# EAGLE design scentclock_2 (EAGLE 5.07)
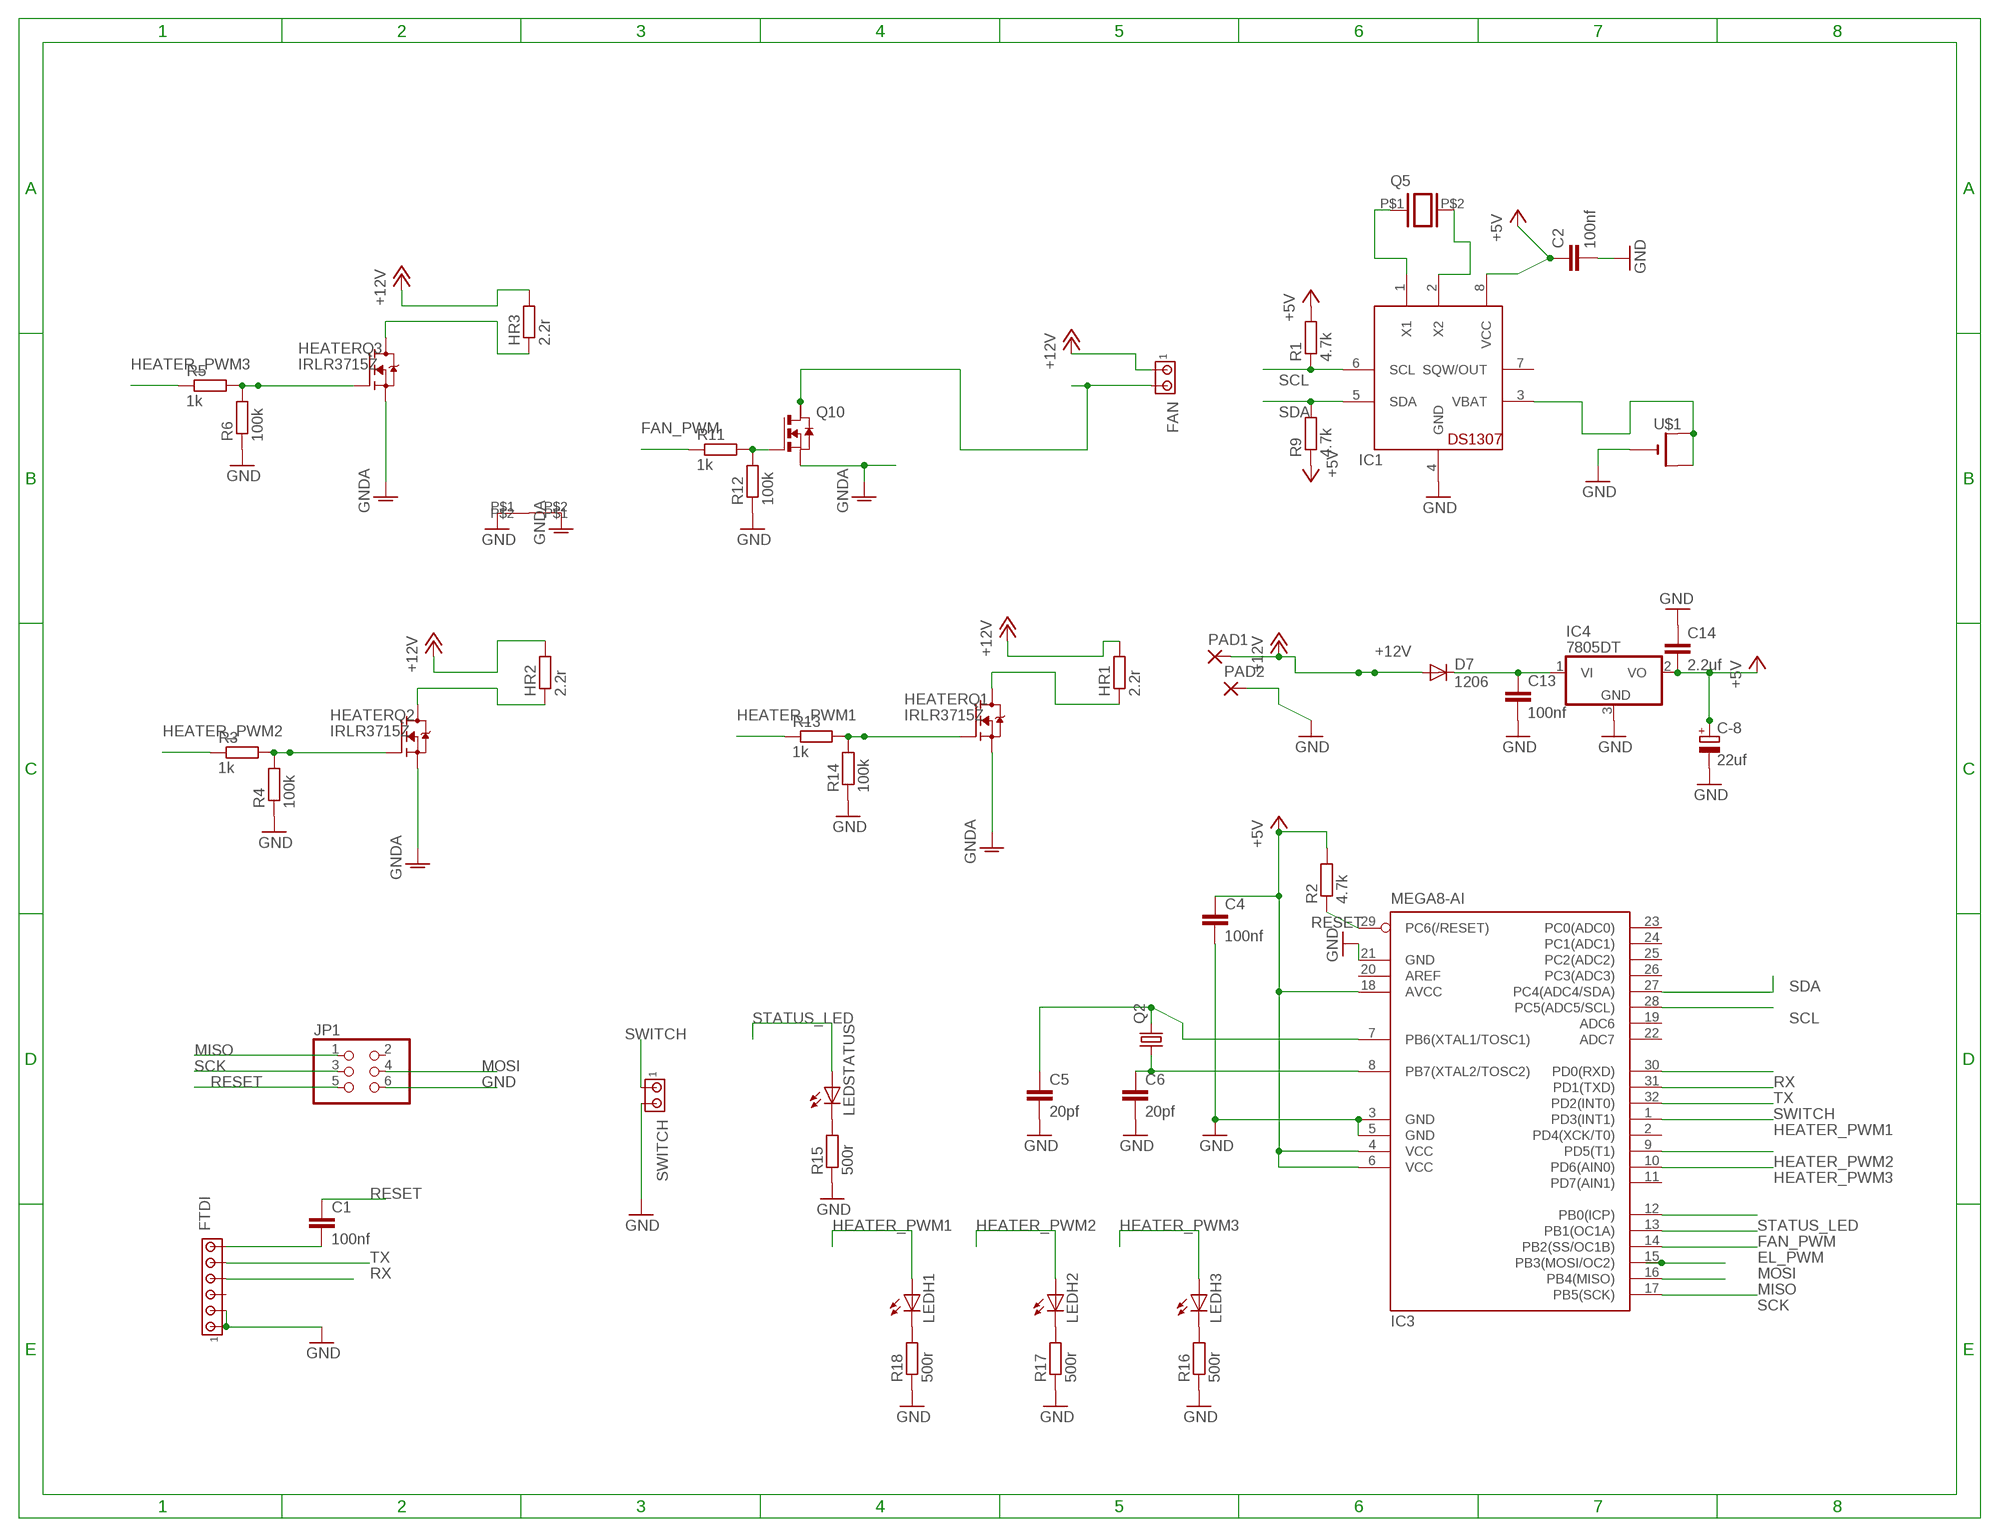
[diagram p0: schematic, sheet 1]

## Parts
C1  100nf  C-EUC1206  [C1206]
C2  100nf  C-EUC1206  [C1206]
C4  100nf  C-EUC1206  [C1206]
C5  20pf  C-EUC1206  [C1206]
C6  20pf  C-EUC1206  [C1206]
C13  100nf  C-EUC1206  [C1206]
C14  2.2uf  C-EUC1206  [C1206]
C-8  22uf  CPOL-EUSMCD  [SMC_D]
D7  1206  DIODE-GF1  [GF1]
FAN  MTA02-100  [10X02MTA]
FTDI  MTA06-100  [10X06MTA]
HEATERQ1  IRLR3715Z  [TO252]
HEATERQ2  IRLR3715Z  [TO252]
HEATERQ3  IRLR3715Z  [TO252]
HR1  2.2r  R-EU_0613/15  [P0613/15]
HR2  2.2r  R-EU_0613/15  [P0613/15]
HR3  2.2r  R-EU_0613/15  [P0613/15]
IC1  DS1307  DS1307SOO8  [SO08]
IC3  MEGA8-AI  [TQFP32-08]
IC4  7805DT  [TO252]
JP1  PINHD-2X3  [2X03]
LEDH1  LEDSMT1206  [1206]
LEDH2  LEDSMT1206  [1206]
LEDH3  LEDSMT1206  [1206]
LEDSTATUS  LEDSMT1206  [1206]
PAD1  2,15/1,0  [2,15/1,0]
PAD2  2,15/1,0  [2,15/1,0]
Q2  CRYSTALHC49UP  [HC49UP]
Q5  XTALSMT  [CC4VCRYSTAL]
Q10  NMOSSOT223  [SOT223]
R1  4.7k  R-EU_R1206  [R1206]
R2  4.7k  R-EU_R1206  [R1206]
R3  1k  R-EU_M1206  [M1206]
R4  100k  R-EU_M1206  [M1206]
R5  1k  R-EU_M1206  [M1206]
R6  100k  R-EU_M1206  [M1206]
R9  4.7k  R-EU_R1206  [R1206]
R11  1k  R-EU_M1206  [M1206]
R12  100k  R-EU_M1206  [M1206]
R13  1k  R-EU_M1206  [M1206]
R14  100k  R-EU_M1206  [M1206]
R15  500r  R-EU_R1206  [R1206]
R16  500r  R-EU_R1206  [R1206]
R17  500r  R-EU_R1206  [R1206]
R18  500r  R-EU_R1206  [R1206]
SWITCH  MTA02-100  [10X02MTA]
U$1  CR1220SMT  [CR1220-SMD]
U$4  SHORT  [SHORT]

## Nets
+5V: C2.1 C4.1 C14.2 C-8.+ IC1.8(VCC) IC3.4(VCC) IC3.6(VCC) IC3.18(AVCC) IC4.2(VO) R1.2 R2.2 R9.1
+12V [power]: D7.A FAN.1 HR1.2 HR2.2 HR3.2 PAD1.1(P)
EL_PWM: IC3.14(PB2(SS/OC1B))
FAN_PWM: IC3.13(PB1(OC1A)) R11.1
GND [power]: C2.2 C4.2 C5.2 C6.2 C13.2 C14.1 C-8.- FTDI.5 FTDI.6 IC1.4(GND) IC3.3(GND) IC3.5(GND) IC3.21(GND) IC4.3(GND) JP1.6 PAD2.1(P) R4.1 R6.1 R12.1 R14.1 R15.1 R16.1 R17.1 R18.1 SWITCH.2 U$1.- U$4.P$1
GNDA [power]: HEATERQ1.2(S) HEATERQ2.2(S) HEATERQ3.2(S) Q10.3(S) U$4.P$2
HEATER [medpower]: HEATERQ1.3(D) HR1.1
HEATER1 [medpower]: HEATERQ2.3(D) HR2.1
HEATER2 [medpower]: HEATERQ3.3(D) HR3.1
HEATER_PWM1: IC3.1(PD3(INT1)) LEDH1.A R13.1
HEATER_PWM2: IC3.9(PD5(T1)) LEDH2.A R3.1
HEATER_PWM3: IC3.10(PD6(AIN0)) LEDH3.A R5.1
MISO: IC3.16(PB4(MISO)) JP1.1
MOSI: IC3.15(PB3(MOSI/OC2)) JP1.4
N$1: HEATERQ2.1(G) R3.2 R4.2
N$2: HEATERQ3.1(G) R5.2 R6.2
N$3: IC1.1(X1) Q5.P$1
N$4 [medpower]: C13.1 D7.C IC4.1(VI)
N$5: C1.2 FTDI.1
N$6: IC1.3(VBAT) U$1.+$1(+) U$1.+$2(+1)
N$7: LEDSTATUS.C R15.2
N$8 [power]: FAN.2 Q10.2(D)
N$9: IC1.2(X2) Q5.P$2
N$10: C6.1 IC3.8(PB7(XTAL2/TOSC2)) Q2.1
N$11: C5.1 IC3.7(PB6(XTAL1/TOSC1)) Q2.2
N$12: LEDH3.C R16.2
N$13: Q10.1(G) R11.2 R12.2
N$14: HEATERQ1.1(G) R13.2 R14.2
N$15: LEDH2.C R17.2
N$16: LEDH1.C R18.2
RESET: C1.1 IC3.29(PC6(/RESET)) JP1.5 R2.1
RX: FTDI.3 IC3.30(PD0(RXD))
SCK: IC3.17(PB5(SCK)) JP1.3
SCL: IC1.6(SCL) IC3.28(PC5(ADC5/SCL)) R1.1
SDA: IC1.5(SDA) IC3.27(PC4(ADC4/SDA)) R9.2
STATUS_LED: IC3.12(PB0(ICP)) LEDSTATUS.A
SWITCH: IC3.32(PD2(INT0)) SWITCH.1
TX: FTDI.2 IC3.31(PD1(TXD))
Unconnected: FTDI.4 IC1.7(SQW/OUT) IC3.2(PD4(XCK/T0)) IC3.11(PD7(AIN1)) IC3.19(ADC6) IC3.20(AREF) IC3.22(ADC7) IC3.23(PC0(ADC0)) IC3.24(PC1(ADC1)) IC3.25(PC2(ADC2)) IC3.26(PC3(ADC3)) JP1.2 Q10.4(D2)

## Library data of the parts
C1 C2 C4-C6 = matt rcl:C-EU: CAPACITOR, European symbol
C13 C14 = resistor:C-EU: CAPACITOR, European symbol
C-8 = matt rcl:CPOL-EU: POLARIZED CAPACITOR, European symbol
D7 = matt diode:DIODE-: DIODE
FAN SWITCH = matt con-amp:MTA02-100: AMP connector
FTDI = matt con-amp:MTA06-100: AMP connector
HEATERQ1-HEATERQ3 = matt transistor-fet:IRLR3715Z
HR1-HR3 R1 R2 R9 R15-R18 = matt rcl:R-EU_: RESISTOR, European symbol
IC1 = adafruit:DS1307: DS1307 Real time clock (RTC) with battery backup ability. Talk to it via i2c
IC3 = matt atmel:MEGA8: MICROCONTROLLER 8 Kbytes FLASH, 1 kbytes SRAM, 512 bytes EEPROM, USART, 6-channel 10 bit ADC, 2-channel 8 bit ADC Pin compatible with Atmega48, ATMega88, ATMega168 Source: avr.lbr
IC4 = linear:78*: Positive VOLTAGE REGULATOR Source: http://cache.national.com/ds/LM/LM78L05.pdf http://www.fairchildsemi.com/ds/LM/LM7805.pdf
JP1 = pinhead:PINHD-2X3: PIN HEADER
LEDH1-LEDH3 LEDSTATUS = matt led:LED: LED OSRAM: - CHIPLED LG R971, LG N971, LY N971, LG Q971, LY Q971, LO R971, LY R971 LH N974, LH R974 LS Q976, LO Q976, LY Q976 LO Q996 - Hyper CHIPLED LW Q18S LB Q993, LB Q99A, LB R99A - SideLED LS A670, LO A670, LY A670, LG A670, LP A670 LB A673, LV A673, LT A673, LW A673 LH A674 LY A675 LS A676, LA A676, LO A676, LY A676, LW A676 LS A679, LY A679, LG A679 - Hyper Micro SIDELED® LS Y876, LA Y876, LO Y876, LY Y876 LT Y87S - SmartLED LW L88C, LW L88S LB L89C, LB L89S, LG L890 LS L89K, LO L89K, LY L89K LS L896, LA L896, LO L896, LY L896 - TOPLED LS T670, LO T670, LY T670, LG T670, LP T670 LSG T670, LSP T670, LSY T670, LOP T670, LYG T670 LG T671, LOG T671, LSG T671 LB T673, LV T673, LT T673, LW T673 LH T674 LS T676, LA T676, LO T676, LY T676, LB T676, LH T676, LSB T676, LW T676 LB T67C, LV T67C, LT T67C, LS T67K, LO T67K, LY T67K, LW E67C LS E67B, LA E67B, LO E67B, LY E67B, LB E67C, LV E67C, LT E67C LW T67C LS T679, LY T679, LG T679 LS T770, LO T770, LY T770, LG T770, LP T770 LB T773, LV T773, LT T773, LW T773 LH T774 LS E675, LA E675, LY E675, LS T675 LS T776, LA T776, LO T776, LY T776, LB T776 LHGB T686 LT T68C, LB T68C - Hyper Mini TOPLED® LB M676 - Mini TOPLED Santana® LG M470 LS M47K, LO M47K, LY M47K Source: http://www.osram.convergy.de LUXEON: - LUMILED® LXK2-PW12-R00, LXK2-PW12-S00, LXK2-PW14-U00, LXK2-PW14-V00 LXK2-PM12-R00, LXK2-PM12-S00, LXK2-PM14-U00 LXK2-PE12-Q00, LXK2-PE12-R00, LXK2-PE12-S00, LXK2-PE14-T00, LXK2-PE14-U00 LXK2-PB12-K00, LXK2-PB12-L00, LXK2-PB12-M00, LXK2-PB14-N00, LXK2-PB14-P00, LXK2-PB14-Q00 LXK2-PR12-L00, LXK2-PR12-M00, LXK2-PR14-Q00, LXK2-PR14-R00 LXK2-PD12-Q00, LXK2-PD12-R00, LXK2-PD12-S00 LXK2-PH12-R00, LXK2-PH12-S00 LXK2-PL12-P00, LXK2-PL12-Q00, LXK2-PL12-R00 Source: www.luxeon.com KINGBRIGHT: KA-3528ASYC Source: www.kingbright.com
PAD1 PAD2 = wirepad:2,15/1,0: THROUGH-HOLE PAD
Q2 = crystal:CRYSTAL: CRYSTAL
Q5 = matt special:XTAL: CRYSTAL
Q10 = zetex:NMOSSOT223: MOS FET
R3-R6 R11-R14 = resistor:R-EU_: RESISTOR, European symbol
U$1 = adafruit:CR1220: CR1216/CR1220/CR1225 12mm 3V lithium coin cell Great for battery packup. Both SMT and THM holders. Note the THM package has the ground pads on both sides of the PCB so that the masks are the same - this reduces the cost
U$4 = matt:SHORT

## Net classes
1 power: width 3 mm
2 medpower: width 1 mm

## Board
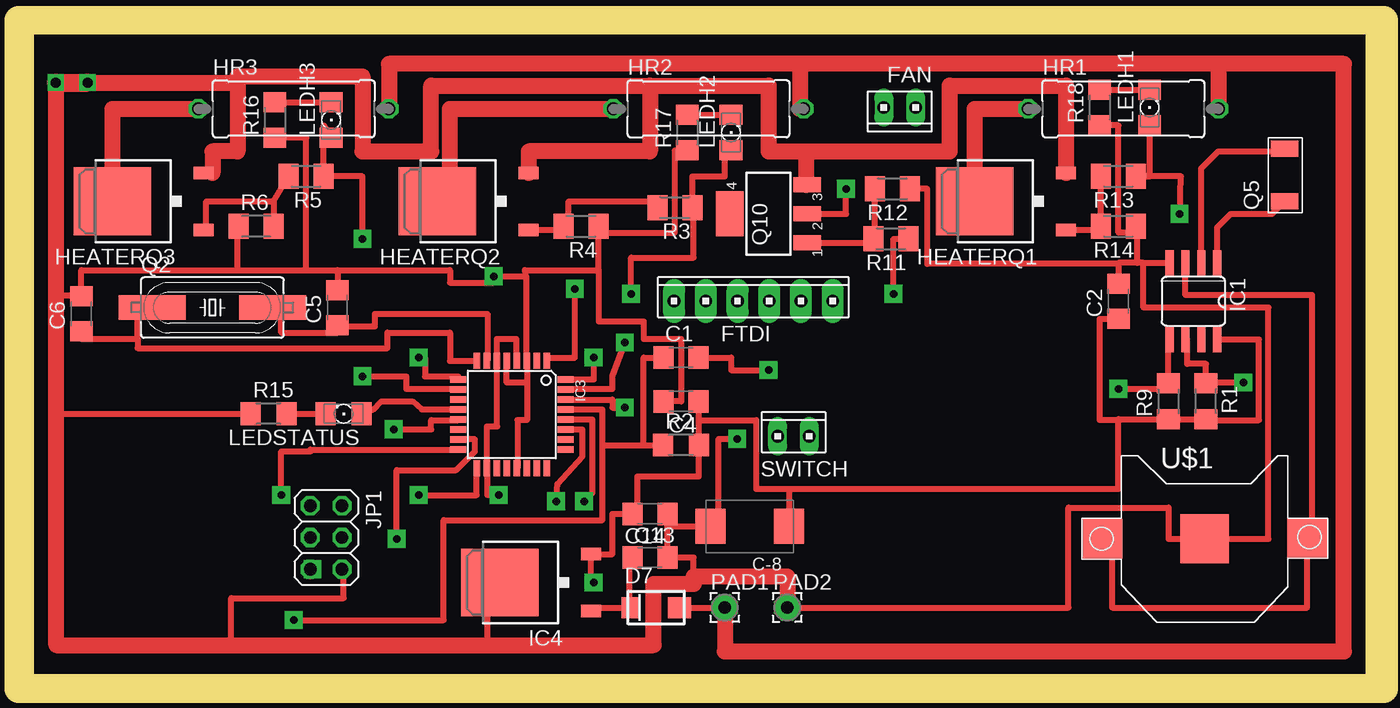
[diagram p1: board, top side]
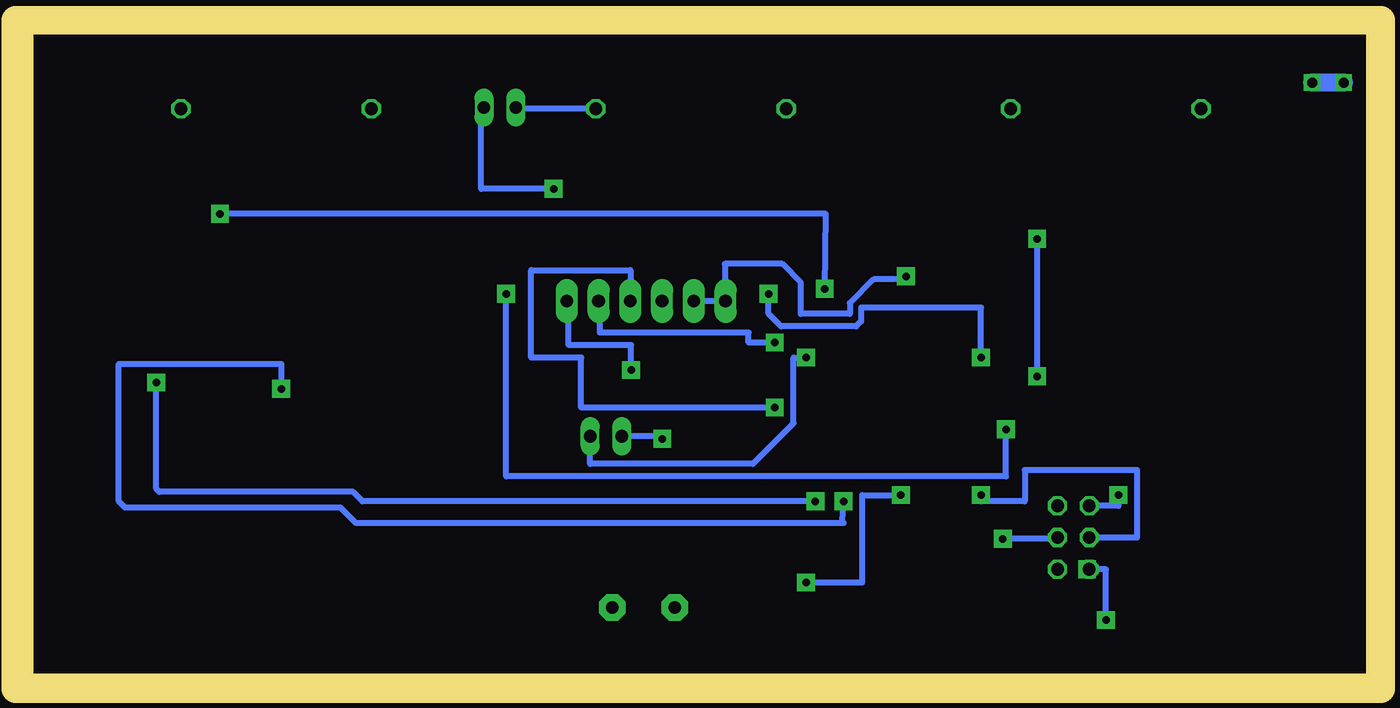
[diagram p2: board, bottom side, seen from below]

Size 107 x 51.6 mm. Coordinates in mm from the lower left corner, seen from the top.
Outline: 0,0 107,0 107,51.6 0,51.6 0,0
Copper layers (1*16): Top 0.035mm / dielectric 1.5mm / Bottom 0.035mm
Design rules "default": minimum track width 10mil, minimum drill 24mil, track to track 8mil, track to pad 8mil, pad to pad 8mil, via to via 8mil, smd to smd 8mil, copper to edge 40mil, drill to drill 8mil, minimum pad ring 10mil, minimum via ring 8mil, stop-mask expansion 4mil, vias tented up to drill 0mil, thermal gap 10mil
Holes 0.6 mm at -1,-1 108,-1
Milling: 4 lines

### Footprints (pad centres in the part's own frame; a part is rotated, then mirrored left to right if it is on the bottom)
C1206 = smd 1.6 x 1.8: 1 -1.4,0; 2 1.4,0
SMC_D = smd 2.4 x 2.8: + -3.15,0; - 3.15,0
GF1 = smd 1.85 x 1.68: A 1.87,0 | smd 1.32 x 1.68: C -2.12,0
10X02MTA = drill 1.016 long: 1 1.27,0; 2 -1.27,0
10X06MTA = drill 1.016 pad 1.778 long: 1 6.35,0; 2 3.81,0; 3 1.27,0; 4 -1.27,0; 5 -3.81,0; 6 -6.35,0
TO252 = smd 1 x 1.6: 1 -2.28,-4.8; 2 2.28,-4.8 | smd 5.4 x 6.2: 3 0,2.5
P0613/15 = drill 1.016 octagon: 1 -7.62,0; 2 7.62,0
SO08 = smd 0.66 x 2.032: 1 -1.905,-3.073; 2 -0.635,-3.073; 3 0.635,-3.073; 4 1.905,-3.073; 5 1.905,3.073; 6 0.635,3.073; 7 -0.635,3.073; 8 -1.905,3.073
TQFP32-08 = smd 1.27 x 0.559: 1 -4.293,2.8; 2 -4.293,2; 3 -4.293,1.2; 4 -4.293,0.4; 5 -4.293,-0.4; 6 -4.293,-1.2; 7 -4.293,-2; 8 -4.293,-2.8; 17 4.293,-2.8; 18 4.293,-2; 19 4.293,-1.2; 20 4.293,-0.4; 21 4.293,0.4; 22 4.293,1.2; 23 4.293,2; 24 4.293,2.8 | smd 0.559 x 1.27: 9 -2.8,-4.293; 10 -2,-4.293; 11 -1.2,-4.293; 12 -0.4,-4.293; 13 0.4,-4.293; 14 1.2,-4.293; 15 2,-4.293; 16 2.8,-4.293; 25 2.8,4.293; 26 2,4.293; 27 1.2,4.293; 28 0.4,4.293; 29 -0.4,4.293; 30 -1.2,4.293; 31 -2,4.293; 32 -2.8,4.293
2X03 = drill 1.016 octagon: 1 -2.54,-1.27; 2 -2.54,1.27; 3 0,-1.27; 4 0,1.27; 5 2.54,-1.27; 6 2.54,1.27
1206 = smd 1.6 x 1.803: A -1.422,0; C 1.422,0
2,15/1,0 = drill 1.016 pad 2.159 octagon: 1 0,0
HC49UP = smd 5.334 x 1.93: 1 -4.826,0; 2 4.826,0
CC4VCRYSTAL = smd 1.3 x 2.2: P$1 -2.5,0; P$2 1.7,0
SOT223 = smd 1.219 x 2.235: 1 -2.311,-3.099; 2 0,-3.099; 3 2.311,-3.099 | smd 3.6 x 2.2: 4 0,3.099
R1206 = smd 1.6 x 1.803: 1 -1.422,0; 2 1.422,0
M1206 = smd 1.6 x 2: 1 -1.4,0; 2 1.4,0
CR1220-SMD = smd 3.2 x 3.2: +$1 -8.2,0; +$2 8.2,0 | smd 3.9 x 3.9: - 0,0
SHORT = drill 0.8 square: P$1 -2.54,0; P$2 0,0

### Placement (x,y rotation side)
C1  52,25.5 0 top
C2  87,30 90 top
C4  52,22 180 top
C5  24.5,29.5 90 top
C6  4,29 90 top
C13  49.5,9.5 0 top
C14  49.5,13 180 top
C-8  57.5,12 180 top
D7  50,5.5 0 top
FAN  69.5,45.5 180 top
FTDI  57.79,30.01 0 top
HEATERQ1  78,38 90 top
HEATERQ2  35,38 90 top
HEATERQ3  9,38 90 top
HR1  87.4,45.4 0 top
HR2  54.2,45.4 0 top
HR3  21,45.4 0 top
IC1  93,30 180 top
IC3  38.46,20.94 270 top
IC4  40,7.5 90 top
JP1  23.6,11.1 270 top
LEDH1  89.5,45.5 90 top
LEDH2  56,43.5 90 top
LEDH3  24,44.5 90 top
LEDSTATUS  25,21 180 top
PAD1  55.5,5.5 0 top
PAD2  60.5,5.5 0 top
Q2  14.5,29.5 0 top
Q5  100.3,40.5 90 top
Q10  59,37 90 top
R1  94,22 270 top
R2  52,18.5 0 top
R3  51.5,37.5 180 top
R4  44,36 180 top
R5  22,40 180 top
R6  18,36 0 top
R9  91,22 90 top
R11  68.8,35 180 top
R12  68.9,39 180 top
R13  87,40 180 top
R14  87,36 180 top
R15  19,21 0 top
R16  19.5,44.5 90 top
R17  52.5,43.5 90 top
R18  85.5,45.5 90 top
SWITCH  61,19.2 0 top
U$1  93.9,11 0 top
U$4  4.5,47.5 0 top

### Tracks (layer width: path | path; a pad name or v marks a point on that pad's centre or on a via)
+5V  (via drill 0.6 pad 1.42)
  Top 0.5: 87,20.5 87,15 60.65,15 | 60.65,15 C-8.+ | IC3.4 38.8,25.23 38.8,27 37.26,27 IC3.6 37.3,25.23 37.3,20 36.46,20 IC3.18 36.5,16.65 36.5,14.5 v37.4,14.5 | C4.1 53.42,22 53.42,20.5 | 53.42,20.5 R2.2 53.42,16 48.5,16 48.5,13 C14.2 46.5,13 46.5,9.78 IC4.2 44.8,7.5 v45,7.5 | 60.65,15 58,15 58,20.5 53.42,20.5 | IC1.8 98.25,26.93 98.25,20.5 94,20.5 R1.2 R9.1 87,20.58 87,20.5 | C2.1 85.5,28.6 85.5,20.5 87,20.5
  Bottom 0.5: v37.4,14.5 40.5,14.5 40.5,7.5 v45,7.5
+12V  (via drill 0.6 pad 1.42)
  Top 0.5: v68.23,45.4 FAN.1 | 61.5,45.4 HR2.2 | 95,45.4 HR1.2 | 51.5,5.5 D7.A PAD1.1
  Top 1.27: 61.5,49 61.5,45.4 | 61.5,49 28.62,49 HR3.2 | 95,49 95,45.4 | 95,49 61.5,49 | PAD1.1 55.5,2 105.05,2 105.05,49 95,49
  Bottom 0.5: HR2.2 v68.23,45.4
FAN_PWM  (via drill 0.6 pad 1.42)
  Top 0.5: v69,30.6 69,35 R11.1 | v29,19.75 32,19.75 32,20.5 34.17,20.5 IC3.13
  Bottom 0.5: v69,30.6 69,16 29,16 v29,19.75
GND  (via drill 0.6 pad 1.42)
  Top 0.5: 2,30.5 4,30.5 C6.2 4,32.5 16.5,32.5 | 24.5,32.5 C5.2 | 16.5,32.5 22,32.5 | R6.1 16.5,36 16.5,32.5 | 88.5,33.07 87,33.07 87,33 | 89,33.07 88.5,33.07 | 89,33.07 IC1.4 | 88.5,33.07 88.5,36 R14.1 88.4,35.5 87,35.5 87,44.08 R18.1 | 89,33.07 89,29.5 99,29.5 99,11 U$1.- 91,11 91,13.5 83,13.5 83,5.5 PAD2.1 60,5.5 | IC3.21 38.9,16.65 38.9,20.5 39.66,20.5 39.66,23.5 | 39.66,23.5 IC3.3 39.6,25.23 39.6,32 | IC3.5 38.05,23.5 39.66,23.5 | 39.6,32 39.5,32.5 45.4,32.5 | 45.4,32.5 45.4,35.5 | 45.4,35.5 R4.1 | IC4.3 36.5,7.5 36.5,2.5 | R16.1 22,43.08 22,32.5 | R17.1 51.5,42.08 51.5,35.5 45.4,35.5 | 39.6,32 v37,32 37,31.5 33.5,31.5 33.5,32.5 24.5,32.5 | v56.5,19 55,19 55,12 C-8.- 50.9,12 C14.1 C13.2 53,9.5 53,8 | 2,21 R15.1 | 2,47.5 U$4.P$1 | R12.1 71.7,39 71.7,33 87,33 | 87,33 C2.2 | 22,32.5 24.5,32.5 | C4.2 52,22 52,27 49,27 49,28.4 45.4,28.4 45.4,32.5 | JP1.6 25,8.56 25,6.25 16,6.25 16,2.5
  Top 1.27: 2,47.5 2,30.5 2,21 2,2.5 16,2.5 36.5,2.5 49.8,2.5 49.8,7.4 53,7.4 53,8 60.5,8 PAD2.1
  Bottom 0.5: FTDI.5 FTDI.6 51.5,30.01 51.5,33 46.9,33 45.4,31.5 45.4,29 41.5,29 41.5,29.85 39.6,31.75 37.25,31.75 v37,32 | 56.5,18.9 v56.5,19 56.7,19.2 SWITCH.2
GNDA
  Top 0.5: 14.5,40.28 HEATERQ3.2 | HEATERQ2.2 39.5,40.28 | 62,42 62.1,42 Q10.3 62,39.31
  Top 1.27: 14.5,40.28 14.5,42 16.5,42 16.5,47.5 | 62,39.31 62,42 59,42 59,47.25 49.5,47.25 | 62.1,42 73.5,42 73.5,47.25 82.8,47.25 HEATERQ1.2 | 49.5,47.25 32,47.25 32,42 26.5,42 26.5,48 16.5,48 16.5,47.5 | 49.5,47.25 49.5,42 39.8,42 HEATERQ2.2 | U$4.P$2 16.5,47.5
HEATER
  Top 1.27: HR1.1 75.5,45.4 HEATERQ1.3
HEATER1
  Top 0.5: HEATERQ2.3 33.5,38
  Top 1.27: HR2.1 33.5,45.4 33.5,38
HEATER2
  Top 1.27: HR3.1 6.5,45.4 HEATERQ3.3
HEATER_PWM1  (via drill 0.6 pad 1.42)
  Top 0.5: LEDH1.A 89.5,40 R13.1 92,40 v91.9,37 | v43.5,31 43.5,25.5 41.26,25.5 IC3.1
  Bottom 0.5: v91.9,37 43.4,37 v43.5,31
HEATER_PWM2  (via drill 0.6 pad 1.42)
  Top 0.5: LEDH2.A 55.5,42.08 55.5,40 52.9,40 R3.1 53,37.5 53,33.5 48,33.5 v48,30.6 | v31,25.5 31.5,25.5 31.5,24 34.17,24 IC3.9
  Bottom 0.5: v31,25.5 31,29.5 40.6,29.5 40.6,28.4 41,28 47,28 48,29 48,30.5 | 48,30.5 v48,30.6 | 48,30.5 47.75,30.5
HEATER_PWM3  (via drill 0.6 pad 1.42)
  Top 0.5: v26.5,35 26.5,40 R5.1 23.4,44.08 LEDH3.A | v26.5,24 30,24 30,23 34.17,23 IC3.10
  Bottom 0.5: v26.5,24 v26.5,35
MISO  (via drill 0.6 pad 1.42)
  Top 0.5: IC3.16 22.33,18.14 22.33,18 20,18 v20,14.5
  Bottom 0.5: JP1.1 20,13.64 v20,14.5
MOSI  (via drill 0.6 pad 1.42)
  Top 0.5: IC3.15 35.5,18.94 35.5,18 34,16.5 29.25,16.5 v29.25,11 | JP1.4 24.87,11
  Bottom 0.5: v29.25,11 24.87,11 JP1.4
N$1
  Top 0.5: HEATERQ2.1 42.6,35.72 R4.2 43,36 43,38 50.1,38 R3.2
N$2
  Top 0.5: HEATERQ3.1 14,35.72 14,38 19.4,38 | 19.4,38 R6.2 | 19.4,38 R5.2
N$3
  Top 0.5: IC1.1 94.91,35.91 96,37 99.3,37 Q5.P$1
N$4
  Top 0.5: D7.C 48.5,5.5 | D7.C 44.8,5.5 IC4.1 | C13.1 47.88,9.5 D7.C
N$5  (via drill 0.6 pad 1.42)
  Top 0.5: v59,24.5 56,24.5 56,25.5 C1.2
  Bottom 0.5: FTDI.1 64,30.01 64,26.5 59,26.5 v59,24.5
N$6
  Top 0.5: IC1.3 92.36,30.5 102.5,30.5 102.5,11 U$1.+$2 102.1,5.5 86.5,5.5 86.5,11 U$1.+$1
N$7
  Top 0.5: R15.2 LEDSTATUS.C
N$8  (via drill 0.6 pad 1.42)
  Top 0.5: v65.2,39 65.2,37 Q10.2
  Bottom 0.5: FAN.2 71,45.5 71,39 v65.2,39
N$9
  Top 0.5: IC1.2 93.64,40.63 95,42 100.1,42 Q5.P$2
N$10
  Top 0.5: Q2.1 8.5,29.5 8.5,27 | 8.5,27 4,27 C6.1 | IC3.8 33.5,25.23 33.5,27.5 28.5,27.5 28.5,26.25 8.5,26.25 8.5,27
N$11
  Top 0.5: Q2.2 20,29.5 20,27.5 24.5,27.5 C5.1 24.5,28 27.5,28 27.5,29 36.5,29 36.5,25.23 IC3.7
N$12
  Top 0.5: R16.2 LEDH3.C
N$13
  Top 0.5: Q10.1 67.09,34.69 R11.2 67.5,35.1 R12.2
N$14
  Top 0.5: R13.2 R14.2 85.6,35.72 HEATERQ1.1
N$15
  Top 0.5: R17.2 LEDH2.C
N$16
  Top 0.5: R18.2 LEDH1.C
RESET  (via drill 0.6 pad 1.42)
  Top 0.5: 22.33,8 JP1.5 v22.5,8.56 | 45.7,18.5 45.7,12.5 33,12.5 33,4.5 v21,4.5 | 45.7,18.5 49,18.5 | 49,18.5 R2.1 | IC3.29 45.7,21.34 45.7,18.5 | C1.1 49,25.5 49,18.5
  Bottom 0.5: v22.5,8.56 21,8.56 v21,4.5
RX  (via drill 0.6 pad 1.42)
  Top 0.5: IC3.30 46.5,22.14 46.5,21.5 v47.5,21.5
  Bottom 0.5: v47.5,21.5 63,21.5 63,25.5 67,25.5 67,32.5 59.06,32.5 FTDI.3
SCK  (via drill 0.6 pad 1.42)
  Top 0.5: v31,14.5 35.66,14.5 IC3.17
  Bottom 0.5: JP1.3 18.5,11.1 18.5,16.5 27.5,16.5 27.5,14 31,14 v31,14.5
SCL  (via drill 0.6 pad 1.42)
  Top 0.5: IC1.6 92.5,26.93 92.5,25 94,25 R1.1 94,23.5 v97,23.5 | IC3.28 44.9,20.54 44.9,14.65 v44.25,14
  Bottom 0.5: v97,23.5 97,15 96.75,14.75 81.25,14.75 80.5,14 v44.25,14
SDA  (via drill 0.6 pad 1.42)
  Top 0.5: IC1.5 91,26.93 R9.2 91,23 v87,23 | v42,14 42.1,15.4 44.1,17.6 44.1,19.74 IC3.27
  Bottom 0.5: v87,23 87,25 100,25 100,14 99.5,13.5 82.25,13.5 81,12.25 42,12.25 42.1,12.35 v42,14
STATUS_LED
  Top 0.5: LEDSTATUS.A 26.42,21.34 27.34,21.34 28,22 30.5,22 31.25,21.35 34.08,21.35 IC3.12
SWITCH  (via drill 0.6 pad 1.42)
  Top 0.5: IC3.32 45,23.74 v45,25.5
  Bottom 0.5: v45,25.5 46,25.5 46,20.25 49.25,17 62.27,17 SWITCH.1
TX  (via drill 0.6 pad 1.42)
  Top 0.5: v47.5,26.7 46.5,24 46.5,23 42.75,23 IC3.31
  Bottom 0.5: FTDI.2 61.5,30.01 61.5,27.5 49.6,27.5 49.6,26.7 v47.5,26.7